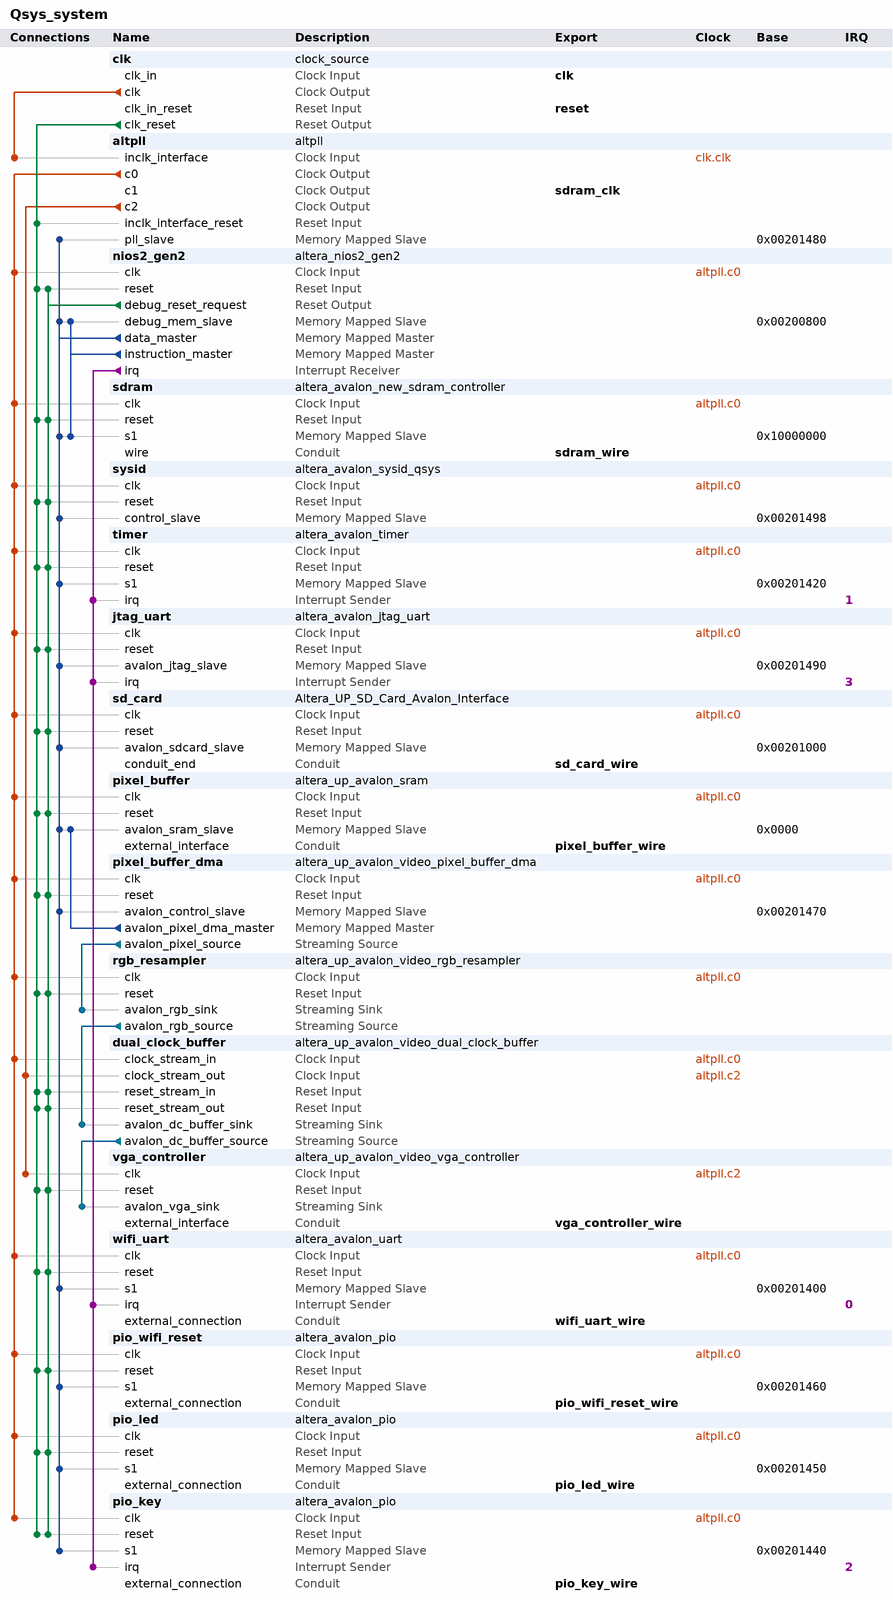
[diagram p0: system contents]
# Platform Designer (Qsys) system Qsys_system, Cyclone IV E EP4CE115F29C7
# Parameters at their usual value, and those the tool derives, are not listed.
package require -exact qsys 15.1
create_system Qsys_system
set_project_property DEVICE_FAMILY {Cyclone IV E}
set_project_property DEVICE EP4CE115F29C7

add_instance clk clock_source 15.1
set_instance_parameter_value clk clockFrequency 50000000

add_instance altpll altpll 15.1
set_instance_parameter_value altpll CLK0_DIVIDE_BY 1
set_instance_parameter_value altpll CLK0_MULTIPLY_BY 1
set_instance_parameter_value altpll CLK1_DIVIDE_BY 1
set_instance_parameter_value altpll CLK1_DUTY_CYCLE 50
set_instance_parameter_value altpll CLK1_MULTIPLY_BY 1
set_instance_parameter_value altpll CLK1_PHASE_SHIFT -3000
set_instance_parameter_value altpll CLK2_DIVIDE_BY 2
set_instance_parameter_value altpll CLK2_DUTY_CYCLE 50
set_instance_parameter_value altpll CLK2_MULTIPLY_BY 1
set_instance_parameter_value altpll CLK2_PHASE_SHIFT 0
set_instance_parameter_value altpll INCLK0_INPUT_FREQUENCY 20000
set_instance_parameter_value altpll PORT_ARESET PORT_UNUSED
set_instance_parameter_value altpll PORT_LOCKED PORT_UNUSED
set_instance_parameter_value altpll PORT_clk1 PORT_USED
set_instance_parameter_value altpll PORT_clk2 PORT_USED
set_instance_parameter_value altpll PORT_clk3 PORT_UNUSED

add_instance nios2_gen2 altera_nios2_gen2 15.1
set_instance_parameter_value nios2_gen2 dcache_size 2048
set_instance_parameter_value nios2_gen2 exceptionSlave sdram.s1
set_instance_parameter_value nios2_gen2 icache_size 4096
set_instance_parameter_value nios2_gen2 impl Fast
set_instance_parameter_value nios2_gen2 resetSlave sdram.s1

add_instance sdram altera_avalon_new_sdram_controller 15.1
set_instance_parameter_value sdram TAC 5.5
set_instance_parameter_value sdram TRCD 20.0
set_instance_parameter_value sdram TRP 20.0
set_instance_parameter_value sdram casLatency 3
set_instance_parameter_value sdram columnWidth 10
set_instance_parameter_value sdram dataWidth 32
set_instance_parameter_value sdram generateSimulationModel false
set_instance_parameter_value sdram model single_Micron_MT48LC4M32B2_7_chip
set_instance_parameter_value sdram numberOfBanks 4
set_instance_parameter_value sdram numberOfChipSelects 1
set_instance_parameter_value sdram powerUpDelay 200.0
set_instance_parameter_value sdram refreshPeriod 7.8125
set_instance_parameter_value sdram rowWidth 13

add_instance sysid altera_avalon_sysid_qsys 15.1
set_instance_parameter_value sysid id 0

add_instance timer altera_avalon_timer 15.1
set_instance_parameter_value timer period 1
set_instance_parameter_value timer periodUnits MSEC

add_instance jtag_uart altera_avalon_jtag_uart 15.1
set_instance_parameter_value jtag_uart simInteractiveOptions NO_INTERACTIVE_WINDOWS

add_instance sd_card Altera_UP_SD_Card_Avalon_Interface 15.1

add_instance pixel_buffer altera_up_avalon_sram 15.1
set_instance_parameter_value pixel_buffer board DE2-115
set_instance_parameter_value pixel_buffer pixel_buffer true

add_instance pixel_buffer_dma altera_up_avalon_video_pixel_buffer_dma 15.1
set_instance_parameter_value pixel_buffer_dma addr_mode X-Y
set_instance_parameter_value pixel_buffer_dma back_start_address 0
set_instance_parameter_value pixel_buffer_dma color_space {24-bit RGB}
set_instance_parameter_value pixel_buffer_dma image_height 480
set_instance_parameter_value pixel_buffer_dma image_width 640
set_instance_parameter_value pixel_buffer_dma start_address 0

add_instance rgb_resampler altera_up_avalon_video_rgb_resampler 15.1
set_instance_parameter_value rgb_resampler alpha 1023
set_instance_parameter_value rgb_resampler input_type {24-bit RGB}
set_instance_parameter_value rgb_resampler output_type {30-bit RGB}

add_instance dual_clock_buffer altera_up_avalon_video_dual_clock_buffer 15.1
set_instance_parameter_value dual_clock_buffer color_bits 10

add_instance vga_controller altera_up_avalon_video_vga_controller 15.1
set_instance_parameter_value vga_controller board DE2-115
set_instance_parameter_value vga_controller resolution {VGA 640x480}

add_instance wifi_uart altera_avalon_uart 15.1
set_instance_parameter_value wifi_uart baud 115200
set_instance_parameter_value wifi_uart dataBits 8
set_instance_parameter_value wifi_uart fixedBaud false
set_instance_parameter_value wifi_uart parity NONE
set_instance_parameter_value wifi_uart stopBits 1
set_instance_parameter_value wifi_uart useCtsRts true

add_instance pio_wifi_reset altera_avalon_pio 15.1
set_instance_parameter_value pio_wifi_reset direction Output
set_instance_parameter_value pio_wifi_reset resetValue 1
set_instance_parameter_value pio_wifi_reset width 1

add_instance pio_led altera_avalon_pio 15.1
set_instance_parameter_value pio_led direction Output
set_instance_parameter_value pio_led width 4

add_instance pio_key altera_avalon_pio 15.1
set_instance_parameter_value pio_key captureEdge true
set_instance_parameter_value pio_key direction Input
set_instance_parameter_value pio_key edgeType FALLING
set_instance_parameter_value pio_key generateIRQ true
set_instance_parameter_value pio_key irqType EDGE
set_instance_parameter_value pio_key width 2

# connections
add_connection altpll.c0 dual_clock_buffer.clock_stream_in clock
add_connection altpll.c0 jtag_uart.clk clock
add_connection altpll.c0 nios2_gen2.clk clock
add_connection altpll.c0 pio_key.clk clock
add_connection altpll.c0 pio_led.clk clock
add_connection altpll.c0 pio_wifi_reset.clk clock
add_connection altpll.c0 pixel_buffer.clk clock
add_connection altpll.c0 pixel_buffer_dma.clk clock
add_connection altpll.c0 rgb_resampler.clk clock
add_connection altpll.c0 sd_card.clk clock
add_connection altpll.c0 sdram.clk clock
add_connection altpll.c0 sysid.clk clock
add_connection altpll.c0 timer.clk clock
add_connection altpll.c0 wifi_uart.clk clock
add_connection altpll.c2 dual_clock_buffer.clock_stream_out clock
add_connection altpll.c2 vga_controller.clk clock
add_connection clk.clk altpll.inclk_interface clock
add_connection clk.clk_reset altpll.inclk_interface_reset reset
add_connection clk.clk_reset dual_clock_buffer.reset_stream_in reset
add_connection clk.clk_reset dual_clock_buffer.reset_stream_out reset
add_connection clk.clk_reset jtag_uart.reset reset
add_connection clk.clk_reset nios2_gen2.reset reset
add_connection clk.clk_reset pio_key.reset reset
add_connection clk.clk_reset pio_led.reset reset
add_connection clk.clk_reset pio_wifi_reset.reset reset
add_connection clk.clk_reset pixel_buffer.reset reset
add_connection clk.clk_reset pixel_buffer_dma.reset reset
add_connection clk.clk_reset rgb_resampler.reset reset
add_connection clk.clk_reset sd_card.reset reset
add_connection clk.clk_reset sdram.reset reset
add_connection clk.clk_reset sysid.reset reset
add_connection clk.clk_reset timer.reset reset
add_connection clk.clk_reset vga_controller.reset reset
add_connection clk.clk_reset wifi_uart.reset reset
add_connection nios2_gen2.debug_reset_request dual_clock_buffer.reset_stream_in reset
add_connection nios2_gen2.debug_reset_request dual_clock_buffer.reset_stream_out reset
add_connection nios2_gen2.debug_reset_request jtag_uart.reset reset
add_connection nios2_gen2.debug_reset_request nios2_gen2.reset reset
add_connection nios2_gen2.debug_reset_request pio_key.reset reset
add_connection nios2_gen2.debug_reset_request pio_led.reset reset
add_connection nios2_gen2.debug_reset_request pio_wifi_reset.reset reset
add_connection nios2_gen2.debug_reset_request pixel_buffer.reset reset
add_connection nios2_gen2.debug_reset_request pixel_buffer_dma.reset reset
add_connection nios2_gen2.debug_reset_request rgb_resampler.reset reset
add_connection nios2_gen2.debug_reset_request sd_card.reset reset
add_connection nios2_gen2.debug_reset_request sdram.reset reset
add_connection nios2_gen2.debug_reset_request sysid.reset reset
add_connection nios2_gen2.debug_reset_request timer.reset reset
add_connection nios2_gen2.debug_reset_request vga_controller.reset reset
add_connection nios2_gen2.debug_reset_request wifi_uart.reset reset
add_connection nios2_gen2.data_master altpll.pll_slave avalon
set_connection_parameter_value nios2_gen2.data_master/altpll.pll_slave baseAddress 0x00201480
add_connection nios2_gen2.data_master jtag_uart.avalon_jtag_slave avalon
set_connection_parameter_value nios2_gen2.data_master/jtag_uart.avalon_jtag_slave baseAddress 0x00201490
add_connection nios2_gen2.data_master nios2_gen2.debug_mem_slave avalon
set_connection_parameter_value nios2_gen2.data_master/nios2_gen2.debug_mem_slave baseAddress 0x00200800
add_connection nios2_gen2.data_master pio_key.s1 avalon
set_connection_parameter_value nios2_gen2.data_master/pio_key.s1 baseAddress 0x00201440
add_connection nios2_gen2.data_master pio_led.s1 avalon
set_connection_parameter_value nios2_gen2.data_master/pio_led.s1 baseAddress 0x00201450
add_connection nios2_gen2.data_master pio_wifi_reset.s1 avalon
set_connection_parameter_value nios2_gen2.data_master/pio_wifi_reset.s1 baseAddress 0x00201460
add_connection nios2_gen2.data_master pixel_buffer.avalon_sram_slave avalon
set_connection_parameter_value nios2_gen2.data_master/pixel_buffer.avalon_sram_slave baseAddress 0x0000
add_connection nios2_gen2.data_master pixel_buffer_dma.avalon_control_slave avalon
set_connection_parameter_value nios2_gen2.data_master/pixel_buffer_dma.avalon_control_slave baseAddress 0x00201470
add_connection nios2_gen2.data_master sd_card.avalon_sdcard_slave avalon
set_connection_parameter_value nios2_gen2.data_master/sd_card.avalon_sdcard_slave baseAddress 0x00201000
add_connection nios2_gen2.data_master sdram.s1 avalon
set_connection_parameter_value nios2_gen2.data_master/sdram.s1 baseAddress 0x10000000
add_connection nios2_gen2.data_master sysid.control_slave avalon
set_connection_parameter_value nios2_gen2.data_master/sysid.control_slave baseAddress 0x00201498
add_connection nios2_gen2.data_master timer.s1 avalon
set_connection_parameter_value nios2_gen2.data_master/timer.s1 baseAddress 0x00201420
add_connection nios2_gen2.data_master wifi_uart.s1 avalon
set_connection_parameter_value nios2_gen2.data_master/wifi_uart.s1 baseAddress 0x00201400
add_connection nios2_gen2.instruction_master nios2_gen2.debug_mem_slave avalon
set_connection_parameter_value nios2_gen2.instruction_master/nios2_gen2.debug_mem_slave baseAddress 0x00200800
add_connection nios2_gen2.instruction_master sdram.s1 avalon
set_connection_parameter_value nios2_gen2.instruction_master/sdram.s1 baseAddress 0x10000000
add_connection pixel_buffer_dma.avalon_pixel_dma_master pixel_buffer.avalon_sram_slave avalon
set_connection_parameter_value pixel_buffer_dma.avalon_pixel_dma_master/pixel_buffer.avalon_sram_slave baseAddress 0x0000
add_connection dual_clock_buffer.avalon_dc_buffer_source vga_controller.avalon_vga_sink avalon_streaming
add_connection pixel_buffer_dma.avalon_pixel_source rgb_resampler.avalon_rgb_sink avalon_streaming
add_connection rgb_resampler.avalon_rgb_source dual_clock_buffer.avalon_dc_buffer_sink avalon_streaming
add_connection nios2_gen2.irq jtag_uart.irq interrupt
set_connection_parameter_value nios2_gen2.irq/jtag_uart.irq irqNumber 3
add_connection nios2_gen2.irq pio_key.irq interrupt
set_connection_parameter_value nios2_gen2.irq/pio_key.irq irqNumber 2
add_connection nios2_gen2.irq timer.irq interrupt
set_connection_parameter_value nios2_gen2.irq/timer.irq irqNumber 1
add_connection nios2_gen2.irq wifi_uart.irq interrupt
set_connection_parameter_value nios2_gen2.irq/wifi_uart.irq irqNumber 0

# exported interfaces
add_interface clk clock sink
set_interface_property clk EXPORT_OF clk.clk_in
add_interface pio_key_wire conduit end
set_interface_property pio_key_wire EXPORT_OF pio_key.external_connection
add_interface pio_led_wire conduit end
set_interface_property pio_led_wire EXPORT_OF pio_led.external_connection
add_interface pio_wifi_reset_wire conduit end
set_interface_property pio_wifi_reset_wire EXPORT_OF pio_wifi_reset.external_connection
add_interface pixel_buffer_wire conduit end
set_interface_property pixel_buffer_wire EXPORT_OF pixel_buffer.external_interface
add_interface reset reset sink
set_interface_property reset EXPORT_OF clk.clk_in_reset
add_interface sd_card_wire conduit end
set_interface_property sd_card_wire EXPORT_OF sd_card.conduit_end
add_interface sdram_clk clock source
set_interface_property sdram_clk EXPORT_OF altpll.c1
add_interface sdram_wire conduit end
set_interface_property sdram_wire EXPORT_OF sdram.wire
add_interface vga_controller_wire conduit end
set_interface_property vga_controller_wire EXPORT_OF vga_controller.external_interface
add_interface wifi_uart_wire conduit end
set_interface_property wifi_uart_wire EXPORT_OF wifi_uart.external_connection

set_interconnect_requirement {$system} qsys_mm.clockCrossingAdapter HANDSHAKE
set_interconnect_requirement {$system} qsys_mm.enableEccProtection FALSE
set_interconnect_requirement {$system} qsys_mm.insertDefaultSlave FALSE
set_interconnect_requirement {$system} qsys_mm.maxAdditionalLatency 1

save_system Qsys_system.qsys
